# EAGLE design eagle-TSL230RD (EAGLE 7.2.0)
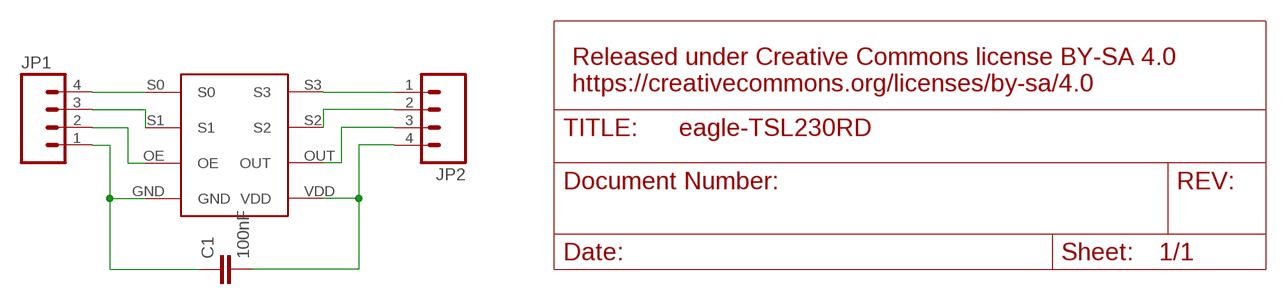
[diagram p0: schematic, sheet 1]

## Parts
C1  100nF  CAP0805  [0805]
JP1  M04PTH  [1X04]
JP2  M04PTH  [1X04]
U$1  TSL230RDSMD  [TSL230RD]

## Nets
N$1: JP1.4 U$1.S0
N$2: JP1.3 U$1.S1
N$3: JP1.2 U$1.OE
N$4: C1.1 JP1.1 U$1.GND
N$5: JP2.1 U$1.S3
N$6: JP2.2 U$1.S2
N$7: JP2.3 U$1.OUT
N$8: C1.2 JP2.4 U$1.VDD

## Notes on the sheet
- Released under Creative Commons license BY-SA 4.0
  https://creativecommons.org/licenses/by-sa/4.0

## Library data of the parts
C1 = SparkFun-Capacitors:CAP: Capacitor Standard 0603 ceramic capacitor, and 0.1" leaded capacitor.
JP1 JP2 = SparkFun-Connectors:M04: Header 4 Standard 4-pin 0.1" header. Use with straight break away headers (SKU : PRT-00116), right angle break away headers (PRT-00553), swiss pins (PRT-00743), machine pins (PRT-00117), and female headers (PRT-00115). Molex polarized connector foot print use with SKU : PRT-08231 with associated crimp pins and housings. 1MM SMD Version SKU: PRT-10208
U$1 = awqua_eagle_library:TSL230RD

## Board
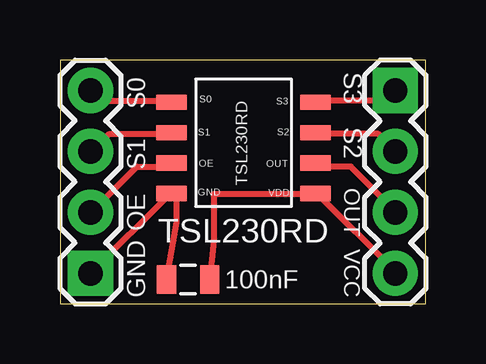
[diagram p1: board, top side]

Size 15.24 x 10.16 mm. Coordinates in mm from the lower left corner, seen from the top.
Outline: 0,0 15.24,0 15.24,10.16 0,10.16 0,0
Copper layers (1*16): Top 0.035mm / dielectric 1.5mm / Bottom 0.035mm
Design rules "default": minimum track width 10mil, minimum drill 24mil, track to track 8mil, track to pad 8mil, pad to pad 8mil, via to via 8mil, smd to smd 8mil, copper to edge 40mil, drill to drill 8mil, minimum pad ring 10mil, minimum via ring 8mil, stop-mask expansion 4mil, vias tented up to drill 0mil, thermal gap 10mil

### Footprints (pad centres in the part's own frame; a part is rotated, then mirrored left to right if it is on the bottom)
0805 = smd 0.8 x 1.2: 1 -0.9,0; 2 0.9,0
1X04 = drill 1.016 pad 1.88 square: 1 0,0 | drill 1.016 pad 1.88: 2 2.54,0; 3 5.08,0; 4 7.62,0
TSL230RD = smd 0.635 x 1.27: GND 0.53,5; OE 1.8,5; OUT 1.8,-1; S0 4.34,5; S1 3.07,5; S2 3.07,-1; S3 4.34,-1; VDD 0.53,-1

### Placement (x,y rotation side)
C1  5.33,1.02 0 top
JP1  1.27,1.27 90 top
JP2  13.97,8.89 270 top
U$1  9.65,4.06 90 top

### Tracks (layer width: path | path; a pad name or v marks a point on that pad's centre or on a via)
N$1
  Top 0.254: U$1.S0 4.57,8.46 1.6,8.46 1.37,8.69 JP1.4
N$2
  Top 0.254: U$1.S1 4.57,7.09 2.06,7.09 1.37,6.4 JP1.3
N$3
  Top 0.254: U$1.OE 4.57,5.71 3.2,5.71 1.37,3.89 JP1.2
N$4
  Top 0.254: C1.1 4.85,3.4 4.85,4.78 4.8,4.57 U$1.GND 4.57,4.57 JP1.1
N$5
  Top 0.254: U$1.S3 10.74,8.46 13.72,8.46 13.95,8.69 JP2.1
N$6
  Top 0.254: U$1.S2 10.74,7.09 13.26,7.09 13.95,6.4 JP2.2
N$7
  Top 0.254: U$1.OUT 10.74,5.71 12.12,5.71 13.95,3.89 JP2.3
N$8
  Top 0.254: C1.2 6.4,2.64 6.4,4.57 10.52,4.57 U$1.VDD 10.74,4.57 13.95,1.37 JP2.4

### Text on the board
tNames: S3 | S0 | S2 | S1 | OUT | OE | TSL230RD | VCC | GND
bNames: AWQUA / TSL230RD / Test Board / 2015/07/14 | github.com/awqua
Document: Released under Creative Commons license BY-SA 4.0 / https://creativecommons.org/licenses/by-sa/4.0